# EasyEDA schematic SCH_Placa-TSM-2026-II_2026-04-09.json
TITLE: Sheet_1; REV: 1.0; Date: 2026-03-24; Sheet: 1/1; Drawn By: urielgd; Company: Your Company
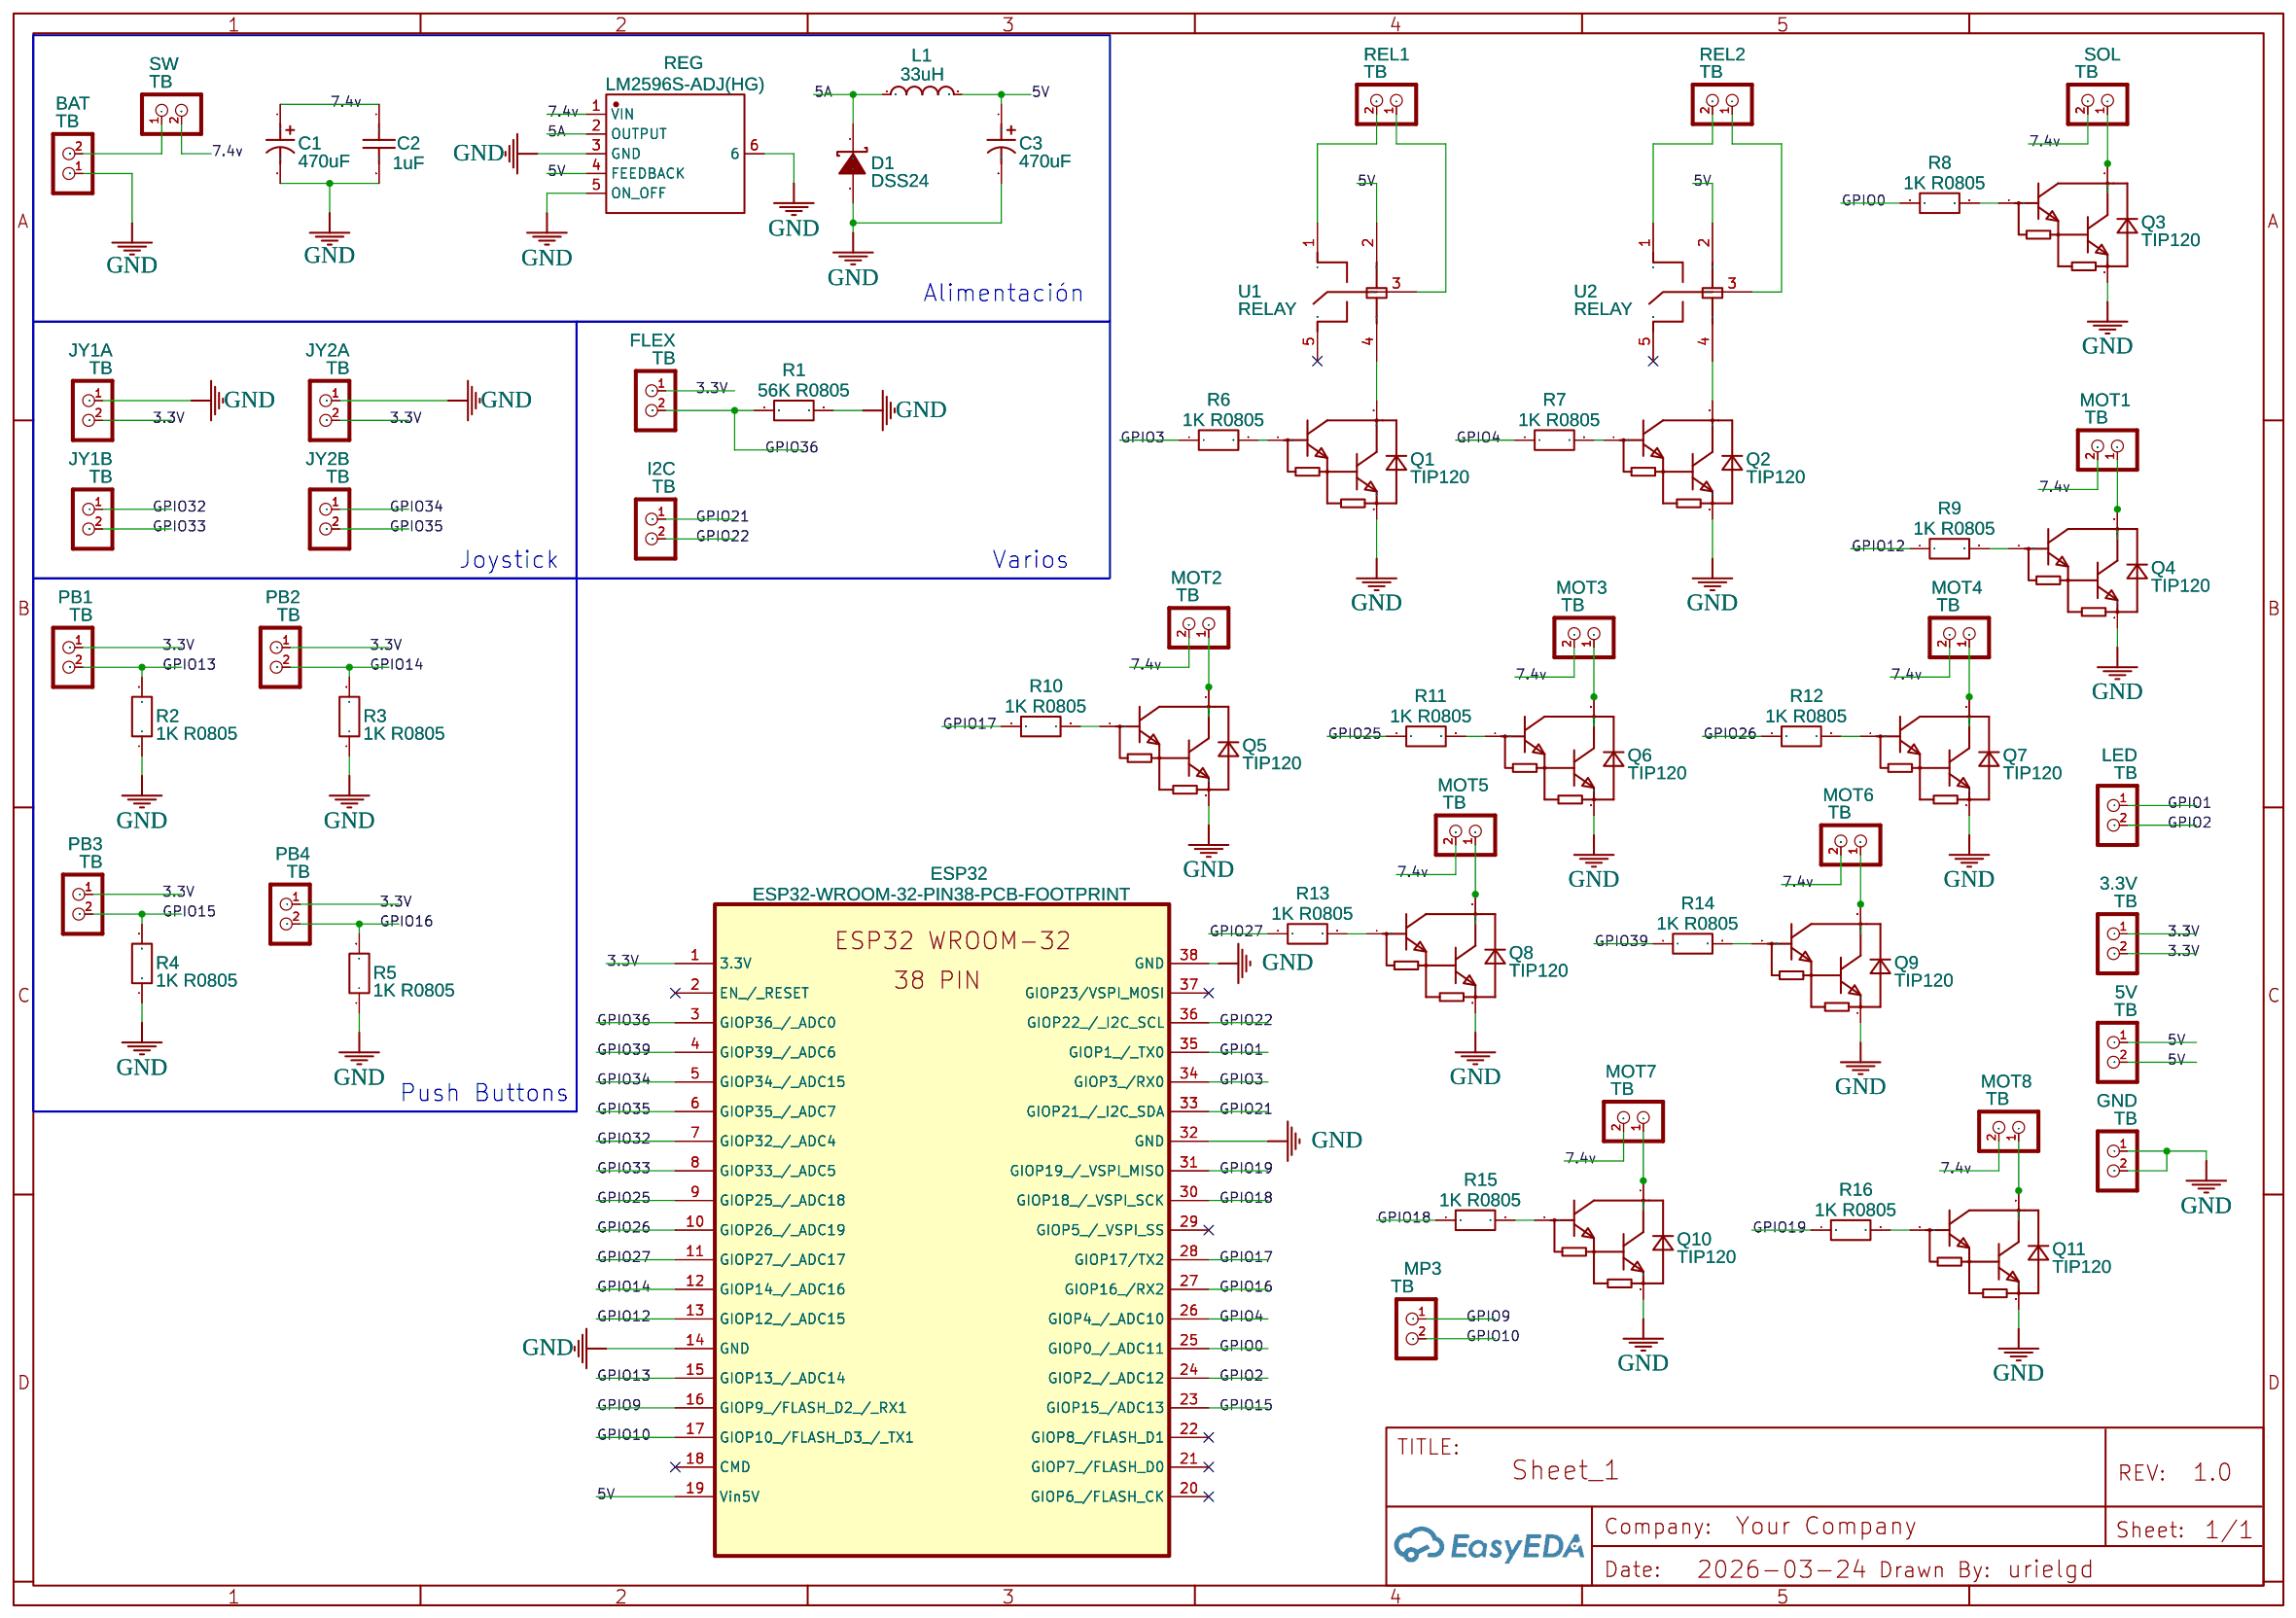
[diagram p0: schematic sheet]

## Parts
3.3V  TB  [TERMINAL_BLOCK_2P_5]
5V  TB  [TERMINAL_BLOCK_2P_5]
BAT  TB  [TERMINAL_BLOCK_2P_5]
C1  470uF  [CAP-TH_BD8.0-P3.50-D0.5-FD]
C2  1uF  [C0805]
C3  470uF  [CAP-TH_BD8.0-P3.50-D0.5-FD]
D1  DSS24  [SOD-123FL_L2.7-W1.8-LS3.8-RD]
ESP32  ESP32-WROOM-32-PIN38-PCB-FOOTPRINT  [ESP32-WROOM-32-38PIN-PCB-FOOTPRINT]
FLEX  TB  [TERMINAL_BLOCK_2P_5]
GND  TB  [TERMINAL_BLOCK_2P_5]
I2C  TB  [TERMINAL_BLOCK_2P_5]
JY1A  TB  [TERMINAL_BLOCK_2P_5]
JY1B  TB  [TERMINAL_BLOCK_2P_5]
JY2A  TB  [TERMINAL_BLOCK_2P_5]
JY2B  TB  [TERMINAL_BLOCK_2P_5]
L1  33uH  [IND-SMD_L6.0-W6.0_HPC6045CF]
LED  TB  [TERMINAL_BLOCK_2P_5]
MOT1  TB  [TERMINAL_BLOCK_2P_5]
MOT2  TB  [TERMINAL_BLOCK_2P_5]
MOT3  TB  [TERMINAL_BLOCK_2P_5]
MOT4  TB  [TERMINAL_BLOCK_2P_5]
MOT5  TB  [TERMINAL_BLOCK_2P_5]
MOT6  TB  [TERMINAL_BLOCK_2P_5]
MOT7  TB  [TERMINAL_BLOCK_2P_5]
MOT8  TB  [TERMINAL_BLOCK_2P_5]
MP3  TB  [TERMINAL_BLOCK_2P_5]
PB1  TB  [TERMINAL_BLOCK_2P_5]
PB2  TB  [TERMINAL_BLOCK_2P_5]
PB3  TB  [TERMINAL_BLOCK_2P_5]
PB4  TB  [TERMINAL_BLOCK_2P_5]
Q1  TIP120  [TO-220-3_L10.0-W4.5-P2.54-L]
Q2  TIP120  [TO-220-3_L10.0-W4.5-P2.54-L]
Q3  TIP120  [TO-220-3_L10.0-W4.5-P2.54-L]
Q4  TIP120  [TO-220-3_L10.0-W4.5-P2.54-L]
Q5  TIP120  [TO-220-3_L10.0-W4.5-P2.54-L]
Q6  TIP120  [TO-220-3_L10.0-W4.5-P2.54-L]
Q7  TIP120  [TO-220-3_L10.0-W4.5-P2.54-L]
Q8  TIP120  [TO-220-3_L10.0-W4.5-P2.54-L]
Q9  TIP120  [TO-220-3_L10.0-W4.5-P2.54-L]
Q10  TIP120  [TO-220-3_L10.0-W4.5-P2.54-L]
Q11  TIP120  [TO-220-3_L10.0-W4.5-P2.54-L]
R1  56K R0805  [R0805]
R2  1K R0805  [R0805]
R3  1K R0805  [R0805]
R4  1K R0805  [R0805]
R5  1K R0805  [R0805]
R6  1K R0805  [R0805]
R7  1K R0805  [R0805]
R8  1K R0805  [R0805]
R9  1K R0805  [R0805]
R10  1K R0805  [R0805]
R11  1K R0805  [R0805]
R12  1K R0805  [R0805]
R13  1K R0805  [R0805]
R14  1K R0805  [R0805]
R15  1K R0805  [R0805]
R16  1K R0805  [R0805]
REG  LM2596S-ADJ(HG)  [TO-263-5_L10.3-W8.4-P1.70-LS15.0-BR]
REL1  TB  [TERMINAL_BLOCK_2P_5]
REL2  TB  [TERMINAL_BLOCK_2P_5]
SOL  TB  [TERMINAL_BLOCK_2P_5]
SW  TB  [TERMINAL_BLOCK_2P_5]
U1  RELAY  [RELAY-TH_RELAY-SPST]
U2  RELAY  [RELAY-TH_RELAY-SPST]

## Library data of the parts
3.3V 5V BAT FLEX GND I2C JY1A JY1B JY2A JY2B LED MOT1-MOT8 MP3 PB1-PB4 REL1 REL2 SOL SW = TERMINAL_BLOCK_2P_5: Contributor: NickNickNickNick
C1 C3 = 16V470UF CD288: Supplier: LCSC; Supplier Part: C2960229; Manufacturer: HRK(鸿瑞凯电子); Manufacturer Part: 16V470uF CD288; Contributor: kmutlu44
C2 = TCC0805X7R105K500DTS: Contributor: LCSC; Supplier: LCSC; Supplier Part: C344178; Manufacturer: CCTC(三环); JLCPCB Part Class: Extended Part
D1 = DSS24: Supplier: LCSC; Manufacturer: 星海; Supplier Part: C84630; JLCPCB Part Class: Extended Part
ESP32 = ESP32-WROOM-32-PIN38-PCB-FOOTPRINT: Manufacturer: Espressif Systems; Manufacturer Part: ESP32-WROOM-32; Supplier Part: 1965-ESP32-DEVKITC-32U-ND; link: https://docs.espressif.com/projects/esp-idf/en/latest/esp32/hw-reference/esp32/get-started-devkitc.html; Contributor: humayun; subpart_no: 1
L1 = HPC6045CF-330M: Contributor: LCSC; Supplier: LCSC; Supplier Part: C357074; Manufacturer: TAI-TECH(台庆); JLCPCB Part Class: Extended Part
Q1-Q11 = TIP120: Contributor: LCSC; Supplier: LCSC; Supplier Part: C262990; Manufacturer: ST(意法半导体); JLCPCB Part Class: Extended Part
R1-R16 = 9.75K R0805: Contributor: lcsc; Supplier: LCSC; Supplier Part: C9900046372; Manufacturer: null
REG = LM2596S-ADJ(HG): Supplier: LCSC; Supplier Part: C53468216; Manufacturer: HGSEMI(华冠); Contributor: lcsc; JLCPCB Part Class: Extended Part
U1 U2 = RELAY: Supplier: LCSC; Supplier Part: C2941249; Manufacturer: null; Manufacturer Part: Relay-SPST; JLCPCB Part Class: Extended Part; Contributor: LCSC

## Nets
3.3V: 3.3V.1 3.3V.2 ESP32.1(3.3V) FLEX.1 JY1A.2 JY2A.2 PB1.1 PB2.1 PB3.1 PB4.1
5V: 5V.1 5V.2 C3.1 ESP32.19(Vin5V) L1.2 REG.4(FEEDBACK) U1.2 U2.2
7.4v: C1.1 C2.1 MOT1.2 MOT2.2 MOT3.2 MOT4.2 MOT5.2 MOT6.2 MOT7.2 MOT8.2 REG.1(VIN) SOL.2 SW.2
GND: BAT.1 C1.2 C2.2 C3.2 D1.2(A) ESP32.14(GND) ESP32.32(GND) ESP32.38(GND) GND.1 GND.2 JY1A.1 JY2A.1 Q1.3(E) Q2.3(E) Q3.3(E) Q4.3(E) Q5.3(E) Q6.3(E) Q7.3(E) Q8.3(E) Q9.3(E) Q10.3(E) Q11.3(E) R1.2 R2.1 R3.1 R4.1 R5.1 REG.3(GND) REG.5(ON_OFF) REG.6
5A: D1.1(C) L1.1 REG.2(OUTPUT)
GPIO0: ESP32.25(GIOP0 / ADC11) R8.1
GPIO1: ESP32.35(GIOP1 / TX0) LED.1
GPIO2: ESP32.24(GIOP2 / ADC12) LED.2
GPIO3: ESP32.34(GIOP3 /RX0) R6.1
GPIO4: ESP32.26(GIOP4 / ADC10) R7.1
GPIO9: ESP32.16(GIOP9 /FLASH D2 / RX1) MP3.1
GPIO10: ESP32.17(GIOP10 /FLASH D3 / TX1) MP3.2
GPIO12: ESP32.13(GIOP12 / ADC15) R9.1
GPIO13: ESP32.15(GIOP13 / ADC14) PB1.2 R2.2
GPIO14: ESP32.12(GIOP14 / ADC16) PB2.2 R3.2
GPIO15: ESP32.23(GIOP15 /ADC13) PB3.2 R4.2
GPIO16: ESP32.27(GIOP16 /RX2) PB4.2 R5.2
GPIO17: ESP32.28(GIOP17/TX2) R10.1
GPIO18: ESP32.30(GIOP18 / VSPI SCK) R15.1
GPIO19: ESP32.31(GIOP19 / VSPI MISO) R16.1
GPIO21: ESP32.33(GIOP21 / I2C SDA) I2C.1
GPIO22: ESP32.36(GIOP22 / I2C SCL) I2C.2
GPIO25: ESP32.9(GIOP25 / ADC18) R11.1
GPIO26: ESP32.10(GIOP26 / ADC19) R12.1
GPIO27: ESP32.11(GIOP27 / ADC17) R13.1
GPIO32: ESP32.7(GIOP32 / ADC4) JY1B.1
GPIO33: ESP32.8(GIOP33 / ADC5) JY1B.2
GPIO34: ESP32.5(GIOP34 / ADC15) JY2B.1
GPIO35: ESP32.6(GIOP35 / ADC7) JY2B.2
GPIO36: ESP32.3(GIOP36 / ADC0) FLEX.2 R1.1
GPIO39: ESP32.4(GIOP39 / ADC6) R14.1
Net-(BAT-2): BAT.2 SW.1
Net-(MOT1-1): MOT1.1 Q4.2(C)
Net-(MOT2-1): MOT2.1 Q5.2(C)
Net-(MOT3-1): MOT3.1 Q6.2(C)
Net-(MOT4-1): MOT4.1 Q7.2(C)
Net-(MOT5-1): MOT5.1 Q8.2(C)
Net-(MOT6-1): MOT6.1 Q9.2(C)
Net-(MOT7-1): MOT7.1 Q10.2(C)
Net-(MOT8-1): MOT8.1 Q11.2(C)
Net-(Q1-1): Q1.1(B) R6.2
Net-(Q1-2): Q1.2(C) U1.4
Net-(Q2-1): Q2.1(B) R7.2
Net-(Q2-2): Q2.2(C) U2.4
Net-(Q3-1): Q3.1(B) R8.2
Net-(Q3-2): Q3.2(C) SOL.1
Net-(Q4-1): Q4.1(B) R9.2
Net-(Q5-1): Q5.1(B) R10.2
Net-(Q6-1): Q6.1(B) R11.2
Net-(Q7-1): Q7.1(B) R12.2
Net-(Q8-1): Q8.1(B) R13.2
Net-(Q9-1): Q9.1(B) R14.2
Net-(Q10-1): Q10.1(B) R15.2
Net-(Q11-1): Q11.1(B) R16.2
Net-(REL1-1): REL1.1 U1.3
Net-(REL1-2): REL1.2 U1.1
Net-(REL2-1): REL2.1 U2.3
Net-(REL2-2): REL2.2 U2.1

Not connected (* = marked no-connect by the designer): ESP32 2(EN / RESET)* 18(CMD)* 20(GIOP6 /FLASH CK)* 21(GIOP7 /FLASH D0)* 22(GIOP8 /FLASH D1)* 29(GIOP5 / VSPI SS)* 37(GIOP23/VSPI MOSI)*; U1 5*; U2 5*

## Notes on the sheet
- Alimentación
- Joystick
- Varios
- Push Buttons
